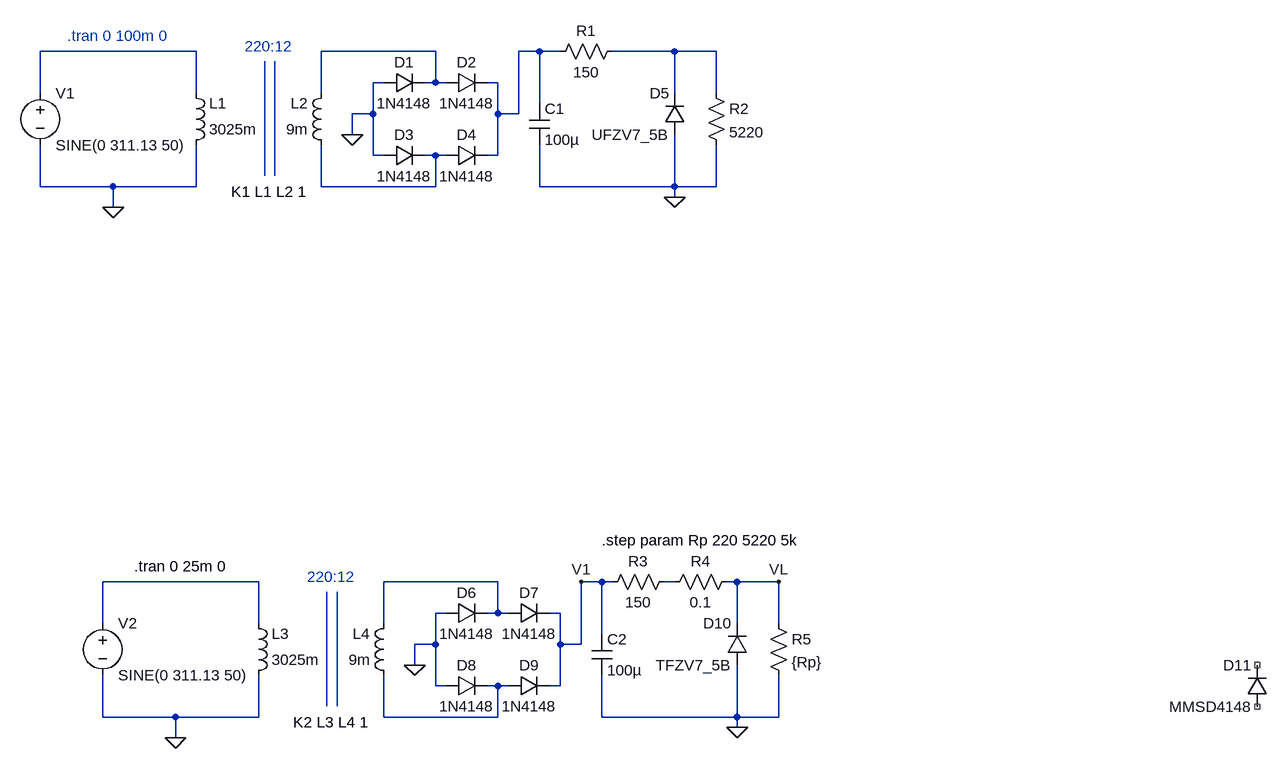
[diagram p0: schematic pre2.asc]
pre2.asc, the LTspice schematic file:
Version 4.1
SHEET 1 6732 3012
WIRE 4992 48 4752 48
WIRE 5360 48 5184 48
WIRE 5520 48 5488 48
WIRE 5552 48 5520 48
WIRE 5728 48 5632 48
WIRE 5792 48 5728 48
WIRE 5280 96 5264 96
WIRE 5360 96 5360 48
WIRE 5360 96 5344 96
WIRE 5376 96 5360 96
WIRE 5456 96 5440 96
WIRE 4752 112 4752 48
WIRE 4992 112 4992 48
WIRE 5184 112 5184 48
WIRE 5728 112 5728 48
WIRE 5792 112 5792 48
WIRE 5520 128 5520 48
WIRE 5264 144 5264 96
WIRE 5264 144 5232 144
WIRE 5456 144 5456 96
WIRE 5488 144 5488 48
WIRE 5488 144 5456 144
WIRE 5232 176 5232 144
WIRE 5264 208 5264 144
WIRE 5280 208 5264 208
WIRE 5360 208 5344 208
WIRE 5376 208 5360 208
WIRE 5456 208 5456 144
WIRE 5456 208 5440 208
WIRE 4752 256 4752 192
WIRE 4864 256 4752 256
WIRE 4992 256 4992 192
WIRE 4992 256 4864 256
WIRE 5184 256 5184 192
WIRE 5360 256 5360 208
WIRE 5360 256 5184 256
WIRE 5520 256 5520 192
WIRE 5728 256 5728 176
WIRE 5728 256 5520 256
WIRE 5792 256 5792 192
WIRE 5792 256 5728 256
WIRE 5728 272 5728 256
WIRE 4864 288 4864 256
WIRE 5088 864 4848 864
WIRE 5456 864 5280 864
WIRE 5616 864 5584 864
WIRE 5632 864 5616 864
WIRE 5728 864 5712 864
WIRE 5824 864 5808 864
WIRE 5888 864 5824 864
WIRE 5376 912 5360 912
WIRE 5456 912 5456 864
WIRE 5456 912 5440 912
WIRE 5472 912 5456 912
WIRE 5552 912 5536 912
WIRE 4848 928 4848 864
WIRE 5088 928 5088 864
WIRE 5280 928 5280 864
WIRE 5824 928 5824 864
WIRE 5888 928 5888 864
WIRE 5616 944 5616 864
WIRE 5360 960 5360 912
WIRE 5360 960 5328 960
WIRE 5552 960 5552 912
WIRE 5584 960 5584 864
WIRE 5584 960 5552 960
WIRE 5328 992 5328 960
WIRE 5360 1024 5360 960
WIRE 5376 1024 5360 1024
WIRE 5456 1024 5440 1024
WIRE 5472 1024 5456 1024
WIRE 5552 1024 5552 960
WIRE 5552 1024 5536 1024
WIRE 4848 1072 4848 1008
WIRE 4960 1072 4848 1072
WIRE 5088 1072 5088 1008
WIRE 5088 1072 4960 1072
WIRE 5280 1072 5280 1008
WIRE 5456 1072 5456 1024
WIRE 5456 1072 5280 1072
WIRE 5616 1072 5616 1008
WIRE 5824 1072 5824 992
WIRE 5824 1072 5616 1072
WIRE 5888 1072 5888 1008
WIRE 5888 1072 5824 1072
WIRE 5824 1088 5824 1072
WIRE 4960 1104 4960 1072
FLAG 4864 288 0
FLAG 5232 176 0
FLAG 5728 272 0
FLAG 4960 1104 0
FLAG 5328 992 0
FLAG 5824 1088 0
FLAG 5584 864 V1
FLAG 5888 864 VL
SYMBOL voltage 4752 96 R0
WINDOW 39 0 0 Left 0
SYMATTR InstName V1
SYMATTR Value SINE(0 311.13 50)
SYMATTR Value2 AC 311
SYMBOL ind 4976 208 M180
WINDOW 0 36 80 Left 2
WINDOW 3 36 40 Left 2
SYMATTR InstName L1
SYMATTR Value 3025m
SYMATTR SpiceLine Rser=.001
SYMBOL ind 5200 208 R180
WINDOW 0 36 80 Left 2
WINDOW 3 36 40 Left 2
SYMATTR InstName L2
SYMATTR Value 9m
SYMBOL diode 5280 112 R270
WINDOW 0 32 32 VTop 2
WINDOW 3 0 32 VBottom 2
SYMATTR InstName D1
SYMATTR Value 1N4148
SYMBOL diode 5376 112 R270
WINDOW 0 32 32 VTop 2
WINDOW 3 0 32 VBottom 2
SYMATTR InstName D2
SYMATTR Value 1N4148
SYMBOL diode 5280 224 R270
WINDOW 0 32 32 VTop 2
WINDOW 3 0 32 VBottom 2
SYMATTR InstName D3
SYMATTR Value 1N4148
SYMBOL diode 5376 224 R270
WINDOW 0 32 32 VTop 2
WINDOW 3 0 32 VBottom 2
SYMATTR InstName D4
SYMATTR Value 1N4148
SYMBOL cap 5504 128 R0
SYMATTR InstName C1
SYMATTR Value 100µ
SYMBOL res 5648 32 R90
WINDOW 0 0 56 VBottom 2
WINDOW 3 32 56 VTop 2
SYMATTR InstName R1
SYMATTR Value 150
SYMBOL diode 5744 176 R180
WINDOW 0 24 64 Left 2
WINDOW 3 24 0 Left 2
SYMATTR InstName D5
SYMATTR Value UFZV7_5B
SYMBOL res 5776 96 R0
SYMATTR InstName R2
SYMATTR Value 5220
SYMBOL voltage 4848 912 R0
WINDOW 39 0 0 Left 0
SYMATTR InstName V2
SYMATTR Value SINE(0 311.13 50)
SYMATTR Value2 AC 311
SYMBOL ind 5072 1024 M180
WINDOW 0 36 80 Left 2
WINDOW 3 36 40 Left 2
SYMATTR InstName L3
SYMATTR Value 3025m
SYMATTR SpiceLine Rser=.001
SYMBOL ind 5296 1024 R180
WINDOW 0 36 80 Left 2
WINDOW 3 36 40 Left 2
SYMATTR InstName L4
SYMATTR Value 9m
SYMBOL diode 5376 928 R270
WINDOW 0 32 32 VTop 2
WINDOW 3 0 32 VBottom 2
SYMATTR InstName D6
SYMATTR Value 1N4148
SYMBOL diode 5472 928 R270
WINDOW 0 32 32 VTop 2
WINDOW 3 0 32 VBottom 2
SYMATTR InstName D7
SYMATTR Value 1N4148
SYMBOL diode 5376 1040 R270
WINDOW 0 32 32 VTop 2
WINDOW 3 0 32 VBottom 2
SYMATTR InstName D8
SYMATTR Value 1N4148
SYMBOL diode 5472 1040 R270
WINDOW 0 32 32 VTop 2
WINDOW 3 0 32 VBottom 2
SYMATTR InstName D9
SYMATTR Value 1N4148
SYMBOL cap 5600 944 R0
SYMATTR InstName C2
SYMATTR Value 100µ
SYMBOL res 5728 848 R90
WINDOW 0 0 56 VBottom 2
WINDOW 3 32 56 VTop 2
SYMATTR InstName R3
SYMATTR Value 150
SYMBOL diode 5840 992 R180
WINDOW 0 24 64 Left 2
WINDOW 3 24 0 Left 2
SYMATTR InstName D10
SYMATTR Value TFZV7_5B
SYMBOL res 5872 912 R0
SYMATTR InstName R5
SYMATTR Value {Rp}
SYMBOL res 5824 848 R90
WINDOW 0 0 56 VBottom 2
WINDOW 3 32 56 VTop 2
SYMATTR InstName R4
SYMATTR Value 0.1
SYMBOL diode 6640 1056 R180
WINDOW 0 24 64 Left 2
WINDOW 3 24 0 Left 2
SYMATTR InstName D11
SYMATTR Value MMSD4148
TEXT 5104 40 Center 2 ;220:12
TEXT 5104 264 Center 2 !K1 L1 L2 1
TEXT 4872 24 Center 2 ;.tran 0 100m 0
TEXT 5200 856 Center 2 ;220:12
TEXT 5200 1080 Center 2 !K2 L3 L4 1
TEXT 4968 840 Center 2 !.tran 0 25m 0
TEXT 5616 800 Left 2 !.step param Rp 220 5220 5k
LINE Normal 5097 239 5097 63
LINE Normal 5113 239 5113 63
LINE Normal 5193 1055 5193 879
LINE Normal 5209 1055 5209 879

The netlist it stands for:
* pre2.asc
V1 N001 0 SINE(0 311.13 50) AC 311
L1 0 N001 3025m Rser=.001
L2 N005 N002 9m
D1 0 N002 1N4148
D2 N002 N003 1N4148
D3 0 N005 1N4148
D4 N005 N003 1N4148
C1 N003 0 100µ
R1 N004 N003 150
D5 0 N004 UFZV7_5B
R2 N004 0 5220
V2 N006 0 SINE(0 311.13 50) AC 311
L3 0 N006 3025m Rser=.001
L4 N009 N007 9m
D6 0 N007 1N4148
D7 N007 V1 1N4148
D8 0 N009 1N4148
D9 N009 V1 1N4148
C2 V1 0 100µ
R3 N008 V1 150
D10 0 VL TFZV7_5B
R5 VL 0 {Rp}
R4 VL N008 0.1
D11 NC_01 NC_02 MMSD4148
.model D D
.lib standard.dio
* 220:12
K1 L1 L2 1
* .tran 0 100m 0
* 220:12
K2 L3 L4 1
.tran 0 25m 0
.step param Rp 220 5220 5k
.backanno
.end